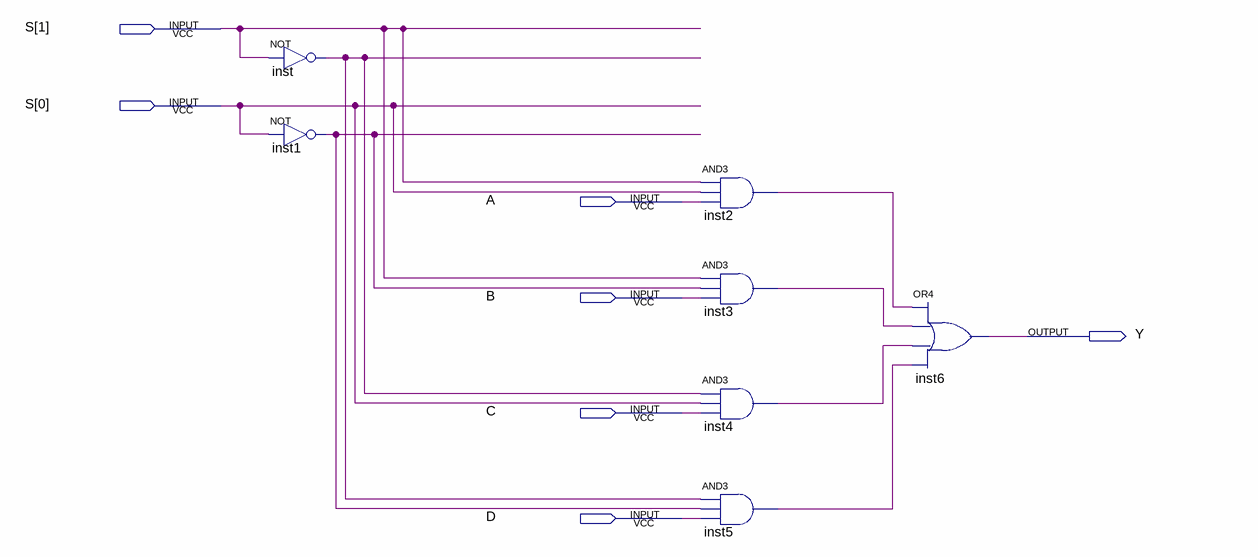
[diagram p0: schematic sheet]
// Quartus schematic multiplexer4x1.bdf as structural Verilog: 7 symbols, 7 pins
module multiplexer4x1 (
  input  [1:0] S,
  input  A,
  input  B,
  input  C,
  input  D,
  output Y
);

  wire inst1_out, inst2_out, inst3_out, inst4_out, inst5_out, inst_out;

  not inst (inst_out, S[1]);
  not inst1 (inst1_out, S[0]);
  and inst2 (inst2_out, S[1], S[0], A);
  and inst3 (inst3_out, S[1], inst1_out, B);
  and inst4 (inst4_out, inst_out, S[0], C);
  and inst5 (inst5_out, inst_out, inst1_out, D);
  or inst6 (Y, inst2_out, inst3_out, inst4_out, inst5_out);
endmodule
